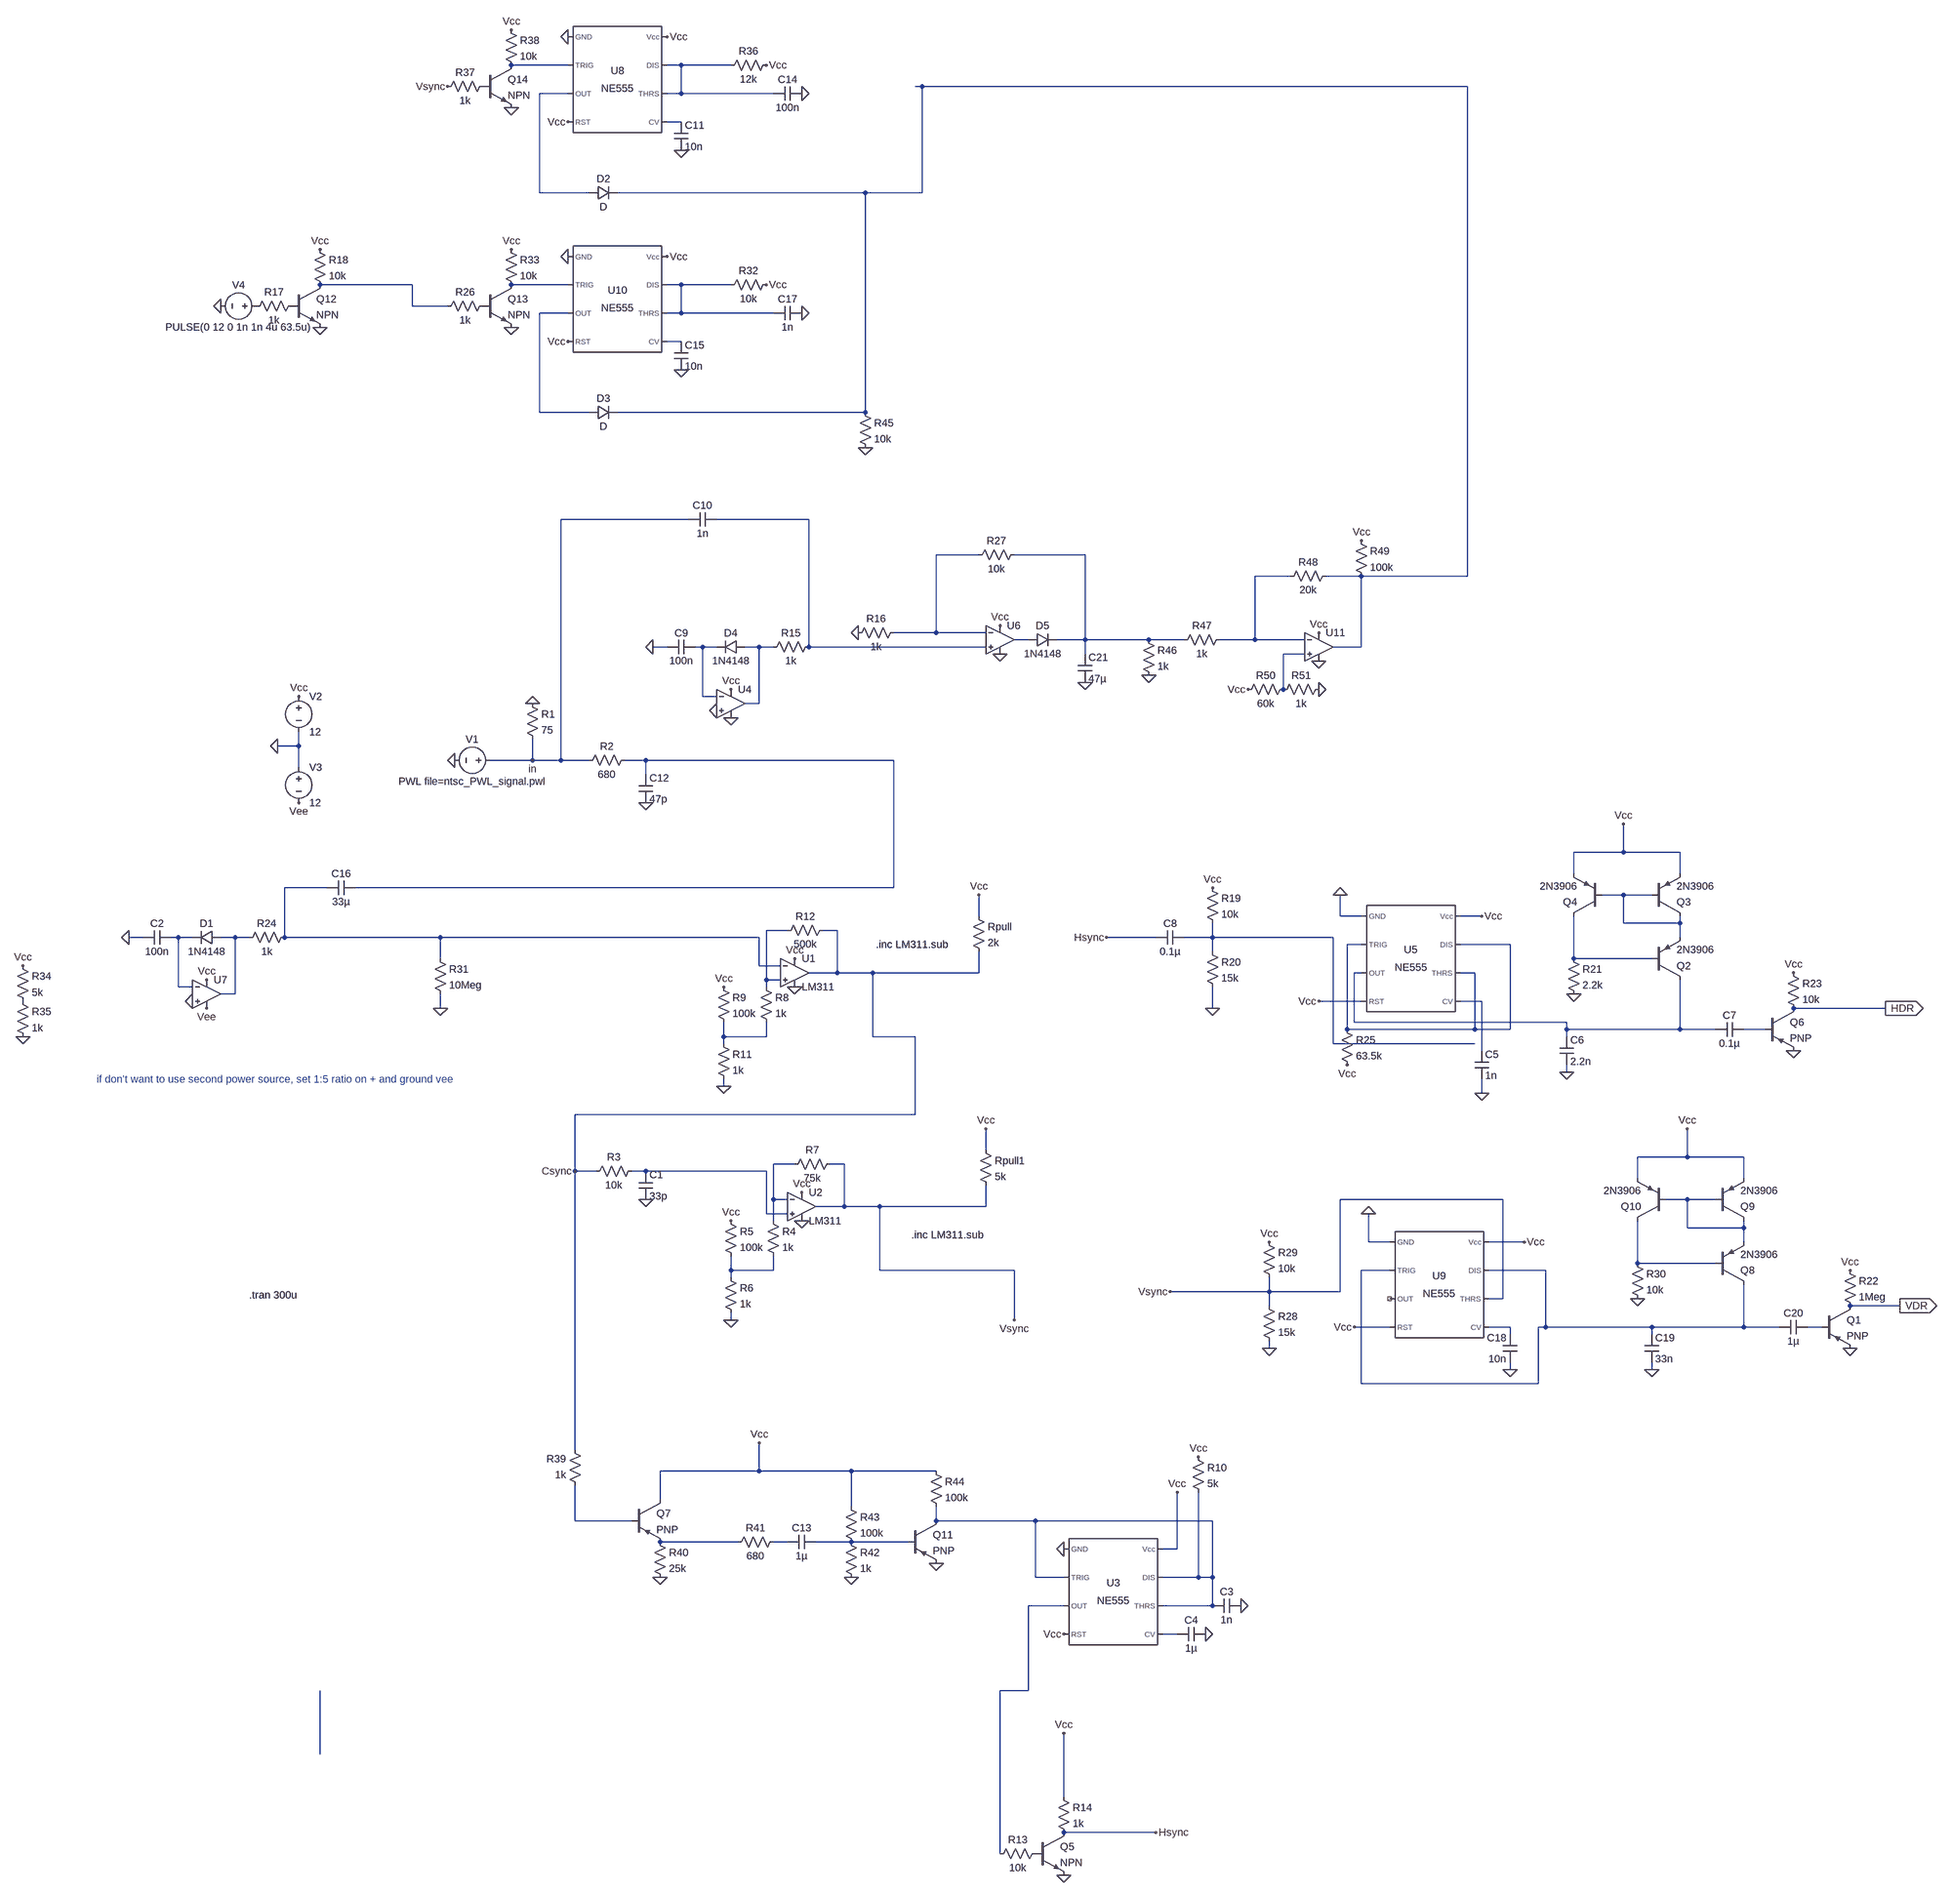
[diagram p0: schematic demoIteration.asc]
demoIteration.asc, the LTspice schematic file:
Version 4.1
SHEET 1 4812 2948
WIRE 240 -1840 112 -1840
WIRE 496 -1840 464 -1840
WIRE 608 -1840 496 -1840
WIRE 1040 -1792 1024 -1792
WIRE 2272 -1792 1040 -1792
WIRE 240 -1776 176 -1776
WIRE 496 -1776 496 -1840
WIRE 496 -1776 464 -1776
WIRE 704 -1776 496 -1776
WIRE 496 -1712 464 -1712
WIRE 176 -1552 176 -1776
WIRE 288 -1552 176 -1552
WIRE 912 -1552 352 -1552
WIRE 1040 -1552 1040 -1792
WIRE 1040 -1552 912 -1552
WIRE -112 -1344 -320 -1344
WIRE 240 -1344 112 -1344
WIRE 496 -1344 464 -1344
WIRE 608 -1344 496 -1344
WIRE -112 -1296 -112 -1344
WIRE -32 -1296 -112 -1296
WIRE 240 -1280 176 -1280
WIRE 496 -1280 496 -1344
WIRE 496 -1280 464 -1280
WIRE 704 -1280 496 -1280
WIRE 496 -1216 464 -1216
WIRE 176 -1056 176 -1280
WIRE 288 -1056 176 -1056
WIRE 912 -1056 912 -1552
WIRE 912 -1056 352 -1056
WIRE 512 -736 224 -736
WIRE 784 -736 576 -736
WIRE 1168 -656 1072 -656
WIRE 1408 -656 1248 -656
WIRE 1872 -608 1792 -608
WIRE 2032 -608 1952 -608
WIRE 2272 -608 2272 -1792
WIRE 2272 -608 2032 -608
WIRE 1072 -480 1072 -656
WIRE 1072 -480 976 -480
WIRE 1184 -480 1072 -480
WIRE 1280 -464 1248 -464
WIRE 1408 -464 1408 -656
WIRE 1408 -464 1344 -464
WIRE 1552 -464 1408 -464
WIRE 1632 -464 1552 -464
WIRE 1792 -464 1792 -608
WIRE 1792 -464 1712 -464
WIRE 1904 -464 1792 -464
WIRE 464 -448 432 -448
WIRE 544 -448 528 -448
WIRE 576 -448 544 -448
WIRE 672 -448 640 -448
WIRE 704 -448 672 -448
WIRE 784 -448 784 -736
WIRE 1184 -448 784 -448
WIRE 2032 -448 2032 -608
WIRE 2032 -448 1968 -448
WIRE 1408 -432 1408 -464
WIRE 1904 -432 1856 -432
WIRE 1856 -352 1856 -432
WIRE 544 -336 544 -448
WIRE 576 -336 544 -336
WIRE 672 -320 672 -448
WIRE 672 -320 640 -320
WIRE -368 -224 -368 -256
WIRE -368 -224 -416 -224
WIRE 160 -192 160 -240
WIRE 160 -192 64 -192
WIRE 224 -192 224 -736
WIRE 224 -192 160 -192
WIRE 288 -192 224 -192
WIRE 416 -192 368 -192
WIRE 976 -192 416 -192
WIRE -368 -176 -368 -224
WIRE 416 -160 416 -192
WIRE 2624 16 2624 -48
WIRE 2624 16 2512 16
WIRE 2752 16 2624 16
WIRE 2512 64 2512 16
WIRE 2752 64 2752 16
WIRE -304 96 -400 96
WIRE 976 96 976 -192
WIRE 976 96 -240 96
WIRE 2624 112 2576 112
WIRE 2688 112 2624 112
WIRE 1168 160 1168 112
WIRE 1984 160 1984 112
WIRE 2032 160 1984 160
WIRE 2304 160 2256 160
WIRE 2624 176 2624 112
WIRE 2752 176 2752 160
WIRE 2752 176 2624 176
WIRE 736 192 688 192
WIRE 848 192 816 192
WIRE -720 208 -752 208
WIRE -640 208 -656 208
WIRE -608 208 -640 208
WIRE -512 208 -544 208
WIRE -480 208 -512 208
WIRE -400 208 -400 96
WIRE -48 208 -400 208
WIRE 672 208 -48 208
WIRE 1568 208 1456 208
WIRE 1696 208 1696 176
WIRE 1696 208 1632 208
WIRE 1968 208 1696 208
WIRE 2752 208 2752 176
WIRE 2032 224 2000 224
WIRE 2368 224 2256 224
WIRE 1696 240 1696 208
WIRE -48 256 -48 208
WIRE 2512 256 2512 160
WIRE 2688 256 2512 256
WIRE 672 272 672 208
WIRE 720 272 672 272
WIRE 848 288 848 192
WIRE 848 288 784 288
WIRE 928 288 848 288
WIRE 1168 288 1168 240
WIRE 1168 288 928 288
WIRE 2032 288 2016 288
WIRE 2288 288 2256 288
WIRE 688 304 688 192
WIRE 720 304 688 304
WIRE -640 320 -640 208
WIRE -608 320 -640 320
WIRE 688 320 688 304
WIRE -512 336 -512 208
WIRE -512 336 -544 336
WIRE 2032 352 1936 352
WIRE 2304 352 2256 352
WIRE -48 368 -48 336
WIRE 1696 368 1696 320
WIRE 3216 368 3008 368
WIRE 2016 400 2016 288
WIRE 2496 400 2016 400
WIRE 2000 416 2000 224
WIRE 2288 416 2288 288
WIRE 2288 416 2000 416
WIRE 2368 416 2368 224
WIRE 2368 416 2288 416
WIRE 2496 416 2496 400
WIRE 2752 416 2752 304
WIRE 2752 416 2496 416
WIRE 2832 416 2752 416
WIRE 2944 416 2896 416
WIRE 592 432 592 400
WIRE 688 432 688 400
WIRE 688 432 592 432
WIRE 928 432 928 288
WIRE 1024 432 928 432
WIRE 2496 432 2496 416
WIRE 592 448 592 432
WIRE 1968 448 1968 208
WIRE 2288 448 1968 448
WIRE 2304 464 2304 352
WIRE 2496 512 2496 496
WIRE 592 544 592 528
WIRE 2304 560 2304 528
WIRE 1024 608 1024 432
WIRE 1024 608 256 608
WIRE 1184 688 1184 640
WIRE 2768 704 2768 640
WIRE 2768 704 2656 704
WIRE 2896 704 2768 704
WIRE 752 720 704 720
WIRE 864 720 832 720
WIRE 256 736 256 608
WIRE 304 736 256 736
WIRE 416 736 384 736
WIRE 688 736 416 736
WIRE 2656 752 2656 704
WIRE 2896 752 2896 704
WIRE 704 800 704 720
WIRE 736 800 704 800
WIRE 2352 800 1984 800
WIRE 2768 800 2720 800
WIRE 2832 800 2768 800
WIRE 864 816 864 720
WIRE 864 816 800 816
WIRE 944 816 864 816
WIRE 1184 816 1184 768
WIRE 1184 816 944 816
WIRE 688 832 688 736
WIRE 736 832 688 832
WIRE 704 848 704 800
WIRE 2768 864 2768 800
WIRE 2896 864 2896 848
WIRE 2896 864 2768 864
WIRE 2048 896 2048 832
WIRE 2096 896 2048 896
WIRE 2400 896 2320 896
WIRE 2896 896 2896 864
WIRE 2656 944 2656 848
WIRE 2832 944 2656 944
WIRE 608 960 608 928
WIRE 704 960 704 928
WIRE 704 960 608 960
WIRE 944 960 944 816
WIRE 1248 960 944 960
WIRE 2096 960 2032 960
WIRE 2448 960 2320 960
WIRE 608 976 608 960
WIRE 1824 1008 1824 976
WIRE 1824 1008 1600 1008
WIRE 1984 1008 1984 800
WIRE 1984 1008 1824 1008
WIRE 2352 1024 2352 800
WIRE 2352 1024 2320 1024
WIRE 1824 1040 1824 1008
WIRE 3248 1040 3136 1040
WIRE 608 1072 608 1056
WIRE 1248 1072 1248 960
WIRE 2096 1088 2016 1088
WIRE 2368 1088 2320 1088
WIRE 2448 1088 2448 960
WIRE 2448 1088 2432 1088
WIRE 2688 1088 2448 1088
WIRE 2896 1088 2896 992
WIRE 2896 1088 2688 1088
WIRE 2976 1088 2896 1088
WIRE 3072 1088 3040 1088
WIRE 2368 1104 2368 1088
WIRE 2688 1104 2688 1088
WIRE 1824 1136 1824 1120
WIRE 2368 1184 2368 1168
WIRE 2688 1184 2688 1168
WIRE 2032 1216 2032 960
WIRE 2432 1216 2432 1088
WIRE 2432 1216 2032 1216
WIRE 256 1472 256 736
WIRE 672 1520 672 1456
WIRE 672 1520 448 1520
WIRE 880 1520 672 1520
WIRE 1072 1520 880 1520
WIRE 448 1584 448 1520
WIRE 880 1600 880 1520
WIRE 256 1632 256 1552
WIRE 384 1632 256 1632
WIRE 1072 1632 1072 1600
WIRE 1296 1632 1072 1632
WIRE 1696 1632 1296 1632
WIRE 624 1680 448 1680
WIRE 736 1680 704 1680
WIRE 880 1680 800 1680
WIRE 1008 1680 880 1680
WIRE 1616 1696 1616 1568
WIRE 1616 1696 1584 1696
WIRE 1296 1760 1296 1632
WIRE 1360 1760 1296 1760
WIRE 1664 1760 1664 1568
WIRE 1664 1760 1584 1760
WIRE 1696 1760 1696 1632
WIRE 1696 1760 1664 1760
WIRE 1360 1824 1280 1824
WIRE 1696 1824 1696 1760
WIRE 1696 1824 1584 1824
WIRE 1616 1888 1584 1888
WIRE 1280 2016 1280 1824
WIRE 1280 2016 1216 2016
WIRE -320 2160 -320 2016
WIRE 1360 2256 1360 2112
WIRE 1568 2336 1360 2336
WIRE 1216 2384 1216 2016
FLAG -16 -192 0
FLAG 160 -320 0
FLAG 1696 96 Vcc
FLAG 1696 368 0
FLAG 1984 112 0
FLAG 2304 560 0
FLAG 2496 512 0
FLAG 2512 336 0
FLAG 3216 368 HDR
IOPIN 3216 368 Out
FLAG 1456 208 Hsync
FLAG 416 -96 0
FLAG 592 544 0
FLAG 752 256 Vcc
FLAG -368 -336 Vcc
FLAG -368 -96 Vee
FLAG -416 -224 0
FLAG 2304 160 Vcc
FLAG 2624 -48 Vcc
FLAG 1936 352 Vcc
FLAG 1168 112 Vcc
FLAG 592 320 Vcc
FLAG -48 368 0
FLAG 416 800 0
FLAG -752 208 0
FLAG -576 304 Vcc
FLAG 608 1072 0
FLAG 1184 640 Vcc
FLAG 608 848 Vcc
FLAG 768 848 0
FLAG 1248 1072 Vsync
FLAG 1824 1136 0
FLAG 1824 896 Vcc
FLAG 2400 896 Vcc
FLAG 2048 832 0
FLAG 2368 1184 0
FLAG 2016 1088 Vcc
FLAG 2656 1024 0
FLAG 2768 640 Vcc
FLAG 2688 1184 0
FLAG 3248 1040 VDR
IOPIN 3248 1040 Out
FLAG 1600 1008 Vsync
FLAG 256 736 Csync
FLAG 1360 1696 0
FLAG 1360 1888 Vcc
FLAG 1760 1824 0
FLAG 1664 1488 Vcc
FLAG 1680 1888 0
FLAG 1360 2432 0
FLAG 3008 288 Vcc
FLAG 3008 464 0
FLAG -1056 432 0
FLAG -1056 272 Vcc
FLAG -608 352 0
FLAG 160 -192 in
FLAG 448 1760 0
FLAG 880 1760 0
FLAG 672 1456 Vcc
FLAG 1072 1728 0
FLAG 1360 2112 Vcc
FLAG 1616 1568 Vcc
FLAG 768 784 Vcc
FLAG 240 -1408 0
FLAG 240 -1216 Vcc
FLAG 496 -1152 0
FLAG 768 -1280 0
FLAG 688 -1344 Vcc
FLAG 464 -1408 Vcc
FLAG 112 -1248 0
FLAG 112 -1424 Vcc
FLAG -32 -1792 Vsync
FLAG 240 -1904 0
FLAG 240 -1712 Vcc
FLAG 496 -1648 0
FLAG 768 -1776 0
FLAG 688 -1840 Vcc
FLAG 464 -1904 Vcc
FLAG 112 -1744 0
FLAG 112 -1920 Vcc
FLAG 912 -976 0
FLAG -576 368 Vee
FLAG 752 320 0
FLAG 2000 496 Vcc
FLAG 1568 2336 Hsync
FLAG 3136 1136 0
FLAG 3136 960 Vcc
FLAG -544 -1296 0
FLAG -320 -1248 0
FLAG -320 -1424 Vcc
FLAG 432 -448 0
FLAG 608 -352 Vcc
FLAG 576 -304 0
FLAG 1216 -496 Vcc
FLAG 896 -480 0
FLAG 1408 -368 0
FLAG 1552 -384 0
FLAG 1936 -480 Vcc
FLAG 2032 -688 Vcc
FLAG 608 -288 0
FLAG 1936 -352 0
FLAG 1776 -352 Vcc
FLAG 1936 -416 0
FLAG 1216 -432 0
DATAFLAG 592 432 ""
DATAFLAG 608 960 ""
SYMBOL voltage 80 -192 R90
WINDOW 0 -32 56 VBottom 2
WINDOW 3 32 56 VTop 2
WINDOW 123 0 0 Left 0
WINDOW 39 0 0 Left 0
SYMATTR InstName V1
SYMATTR Value PWL file=ntsc_PWL_signal.pwl
SYMBOL res 144 -336 R0
SYMATTR InstName R1
SYMATTR Value 75
SYMBOL Misc\\NE555 2144 256 R0
SYMATTR InstName U5
SYMBOL res 1680 80 R0
SYMATTR InstName R19
SYMATTR Value 10k
SYMBOL res 1680 224 R0
SYMATTR InstName R20
SYMATTR Value 15k
SYMBOL cap 2288 464 R0
SYMATTR InstName C5
SYMATTR Value 1n
SYMBOL cap 2480 432 R0
SYMATTR InstName C6
SYMATTR Value 2.2n
SYMBOL cap 2896 400 R90
WINDOW 0 0 32 VBottom 2
WINDOW 3 32 32 VTop 2
SYMATTR InstName C7
SYMATTR Value 0.1µ
SYMBOL pnp 2688 304 M180
SYMATTR InstName Q2
SYMATTR Value 2N3906
SYMBOL pnp 2688 160 M180
SYMATTR InstName Q3
SYMATTR Value 2N3906
SYMBOL pnp 2576 160 R180
SYMATTR InstName Q4
SYMATTR Value 2N3906
SYMBOL res 2496 240 R0
SYMATTR InstName R21
SYMATTR Value 2.2k
SYMBOL cap 1632 192 R90
WINDOW 0 0 32 VBottom 2
WINDOW 3 32 32 VTop 2
SYMATTR InstName C8
SYMATTR Value 0.1µ
SYMBOL res 384 -208 R90
WINDOW 0 0 56 VBottom 2
WINDOW 3 32 56 VTop 2
SYMATTR InstName R2
SYMATTR Value 680
SYMBOL cap 400 -160 R0
SYMATTR InstName C12
SYMATTR Value 47p
SYMBOL res 672 304 R0
SYMATTR InstName R8
SYMATTR Value 1k
SYMBOL res 576 304 R0
SYMATTR InstName R9
SYMATTR Value 100k
SYMBOL res 576 432 R0
SYMATTR InstName R11
SYMATTR Value 1k
SYMBOL res 832 176 R90
WINDOW 0 0 56 VBottom 2
WINDOW 3 32 56 VTop 2
SYMATTR InstName R12
SYMATTR Value 500k
SYMBOL res 1152 144 R0
SYMATTR InstName Rpull
SYMATTR Value 2k
SYMBOL voltage -368 -352 R0
SYMATTR InstName V2
SYMATTR Value 12
SYMBOL voltage -368 -192 R0
SYMATTR InstName V3
SYMATTR Value 12
SYMBOL OpAmps\\opamp2 752 224 R0
SYMATTR InstName U1
SYMATTR Value LM311
SYMBOL res -64 240 R0
SYMATTR InstName R31
SYMATTR Value 10Meg
SYMBOL res 400 720 R90
WINDOW 0 0 56 VBottom 2
WINDOW 3 32 56 VTop 2
SYMATTR InstName R3
SYMATTR Value 10k
SYMBOL cap 400 736 R0
SYMATTR InstName C1
SYMATTR Value 33p
SYMBOL res -384 192 R90
WINDOW 0 0 56 VBottom 2
WINDOW 3 32 56 VTop 2
SYMATTR InstName R24
SYMATTR Value 1k
SYMBOL diode -544 192 R90
WINDOW 0 0 32 VBottom 2
WINDOW 3 32 32 VTop 2
SYMATTR InstName D1
SYMATTR Value 1N4148
SYMBOL cap -656 192 R90
WINDOW 0 0 32 VBottom 2
WINDOW 3 32 32 VTop 2
SYMATTR InstName C2
SYMATTR Value 100n
SYMBOL OpAmps\\UniversalOpAmp2 -576 336 R0
SYMATTR InstName U7
SYMBOL cap -240 80 R90
WINDOW 0 0 32 VBottom 2
WINDOW 3 32 32 VTop 2
SYMATTR InstName C16
SYMATTR Value 33µ
SYMBOL res 688 832 R0
SYMATTR InstName R4
SYMATTR Value 1k
SYMBOL res 592 832 R0
SYMATTR InstName R5
SYMATTR Value 100k
SYMBOL res 592 960 R0
SYMATTR InstName R6
SYMATTR Value 1k
SYMBOL res 848 704 R90
WINDOW 0 0 56 VBottom 2
WINDOW 3 32 56 VTop 2
SYMATTR InstName R7
SYMATTR Value 75k
SYMBOL res 1168 672 R0
SYMATTR InstName Rpull1
SYMATTR Value 5k
SYMBOL OpAmps\\opamp2 768 752 R0
SYMATTR InstName U2
SYMATTR Value LM311
SYMBOL res 1808 1024 R0
SYMATTR InstName R28
SYMATTR Value 15k
SYMBOL res 1808 880 R0
SYMATTR InstName R29
SYMATTR Value 10k
SYMBOL Misc\\NE555 2208 992 R0
SYMATTR InstName U9
SYMBOL cap 2384 1168 R180
WINDOW 0 24 56 Left 2
WINDOW 3 24 8 Left 2
SYMATTR InstName C18
SYMATTR Value 10n
SYMBOL pnp 2832 992 M180
SYMATTR InstName Q8
SYMATTR Value 2N3906
SYMBOL pnp 2832 848 M180
SYMATTR InstName Q9
SYMATTR Value 2N3906
SYMBOL pnp 2720 848 R180
SYMATTR InstName Q10
SYMATTR Value 2N3906
SYMBOL res 2640 928 R0
SYMATTR InstName R30
SYMATTR Value 10k
SYMBOL cap 2672 1104 R0
SYMATTR InstName C19
SYMATTR Value 33n
SYMBOL cap 3040 1072 R90
WINDOW 0 0 32 VBottom 2
WINDOW 3 32 32 VTop 2
SYMATTR InstName C20
SYMATTR Value 1µ
SYMBOL Misc\\NE555 1472 1792 R0
SYMATTR InstName U3
SYMBOL cap 1760 1808 R90
WINDOW 0 0 32 VBottom 2
WINDOW 3 32 32 VTop 2
SYMATTR InstName C3
SYMATTR Value 1n
SYMBOL res 1648 1472 R0
SYMATTR InstName R10
SYMATTR Value 5k
SYMBOL cap 1680 1872 R90
WINDOW 0 0 32 VBottom 2
WINDOW 3 32 32 VTop 2
SYMATTR InstName C4
SYMATTR Value 1µ
SYMBOL res 1312 2368 R90
WINDOW 0 0 56 VBottom 2
WINDOW 3 32 56 VTop 2
SYMATTR InstName R13
SYMATTR Value 10k
SYMBOL npn 1296 2336 R0
SYMATTR InstName Q5
SYMBOL res 1344 2240 R0
SYMATTR InstName R14
SYMATTR Value 1k
SYMBOL res 2992 272 R0
SYMATTR InstName R23
SYMATTR Value 10k
SYMBOL pnp 2944 368 R0
SYMATTR InstName Q6
SYMBOL res -1072 256 R0
SYMATTR InstName R34
SYMATTR Value 5k
SYMBOL res -1072 336 R0
SYMATTR InstName R35
SYMATTR Value 1k
SYMBOL res 272 1568 R180
WINDOW 0 36 76 Left 2
WINDOW 3 36 40 Left 2
SYMATTR InstName R39
SYMATTR Value 1k
SYMBOL res 432 1664 R0
SYMATTR InstName R40
SYMATTR Value 25k
SYMBOL res 720 1664 R90
WINDOW 0 0 56 VBottom 2
WINDOW 3 32 56 VTop 2
SYMATTR InstName R41
SYMATTR Value 680
SYMBOL cap 736 1696 R270
WINDOW 0 32 32 VTop 2
WINDOW 3 0 32 VBottom 2
SYMATTR InstName C13
SYMATTR Value 1µ
SYMBOL res 864 1664 R0
SYMATTR InstName R42
SYMATTR Value 1k
SYMBOL res 864 1584 R0
SYMATTR InstName R43
SYMATTR Value 100k
SYMBOL res 1056 1504 R0
SYMATTR InstName R44
SYMATTR Value 100k
SYMBOL Misc\\NE555 352 -1312 R0
SYMATTR InstName U10
SYMBOL cap 480 -1216 R0
SYMATTR InstName C15
SYMATTR Value 10n
SYMBOL res 704 -1360 R90
WINDOW 0 0 56 VBottom 2
WINDOW 3 32 56 VTop 2
SYMATTR InstName R32
SYMATTR Value 10k
SYMBOL cap 768 -1296 R90
WINDOW 0 0 32 VBottom 2
WINDOW 3 32 32 VTop 2
SYMATTR InstName C17
SYMATTR Value 1n
SYMBOL npn 48 -1344 R0
SYMATTR InstName Q13
SYMBOL res 64 -1312 R90
WINDOW 0 0 56 VBottom 2
WINDOW 3 32 56 VTop 2
SYMATTR InstName R26
SYMATTR Value 1k
SYMBOL res 96 -1440 R0
SYMATTR InstName R33
SYMATTR Value 10k
SYMBOL Misc\\NE555 352 -1808 R0
SYMATTR InstName U8
SYMBOL cap 480 -1712 R0
SYMATTR InstName C11
SYMATTR Value 10n
SYMBOL res 704 -1856 R90
WINDOW 0 0 56 VBottom 2
WINDOW 3 32 56 VTop 2
SYMATTR InstName R36
SYMATTR Value 12k
SYMBOL cap 768 -1792 R90
WINDOW 0 0 32 VBottom 2
WINDOW 3 32 32 VTop 2
SYMATTR InstName C14
SYMATTR Value 100n
SYMBOL npn 48 -1840 R0
SYMATTR InstName Q14
SYMBOL res 64 -1808 R90
WINDOW 0 0 56 VBottom 2
WINDOW 3 32 56 VTop 2
SYMATTR InstName R37
SYMATTR Value 1k
SYMBOL res 96 -1936 R0
SYMATTR InstName R38
SYMATTR Value 10k
SYMBOL diode 288 -1536 R270
WINDOW 0 32 32 VTop 2
WINDOW 3 0 32 VBottom 2
SYMATTR InstName D2
SYMBOL diode 288 -1040 R270
WINDOW 0 32 32 VTop 2
WINDOW 3 0 32 VBottom 2
SYMATTR InstName D3
SYMBOL res 896 -1072 R0
SYMATTR InstName R45
SYMATTR Value 10k
SYMBOL res 1984 400 R0
SYMATTR InstName R25
SYMATTR Value 63.5k
SYMBOL res 3120 944 R0
SYMATTR InstName R22
SYMATTR Value 1Meg
SYMBOL pnp 3072 1040 R0
SYMATTR InstName Q1
SYMBOL voltage -448 -1296 R90
WINDOW 0 -32 56 VBottom 2
WINDOW 3 32 56 VTop 2
WINDOW 123 0 0 Left 0
WINDOW 39 0 0 Left 0
SYMATTR InstName V4
SYMATTR Value PULSE(0 12 0 1n 1n 4u 63.5u)
SYMBOL res -368 -1312 R90
WINDOW 0 0 56 VBottom 2
WINDOW 3 32 56 VTop 2
SYMATTR InstName R17
SYMATTR Value 1k
SYMBOL npn -384 -1344 R0
SYMATTR InstName Q12
SYMBOL res -336 -1440 R0
SYMATTR InstName R18
SYMATTR Value 10k
SYMBOL res 800 -464 R90
WINDOW 0 0 56 VBottom 2
WINDOW 3 32 56 VTop 2
SYMATTR InstName R15
SYMATTR Value 1k
SYMBOL diode 640 -464 R90
WINDOW 0 0 32 VBottom 2
WINDOW 3 32 32 VTop 2
SYMATTR InstName D4
SYMATTR Value 1N4148
SYMBOL cap 528 -464 R90
WINDOW 0 0 32 VBottom 2
WINDOW 3 32 32 VTop 2
SYMATTR InstName C9
SYMATTR Value 100n
SYMBOL OpAmps\\UniversalOpAmp2 608 -320 R0
SYMATTR InstName U4
SYMBOL cap 576 -752 R90
WINDOW 0 0 32 VBottom 2
WINDOW 3 32 32 VTop 2
SYMATTR InstName C10
SYMATTR Value 1n
SYMBOL OpAmps\\UniversalOpAmp2 1216 -464 R0
SYMATTR InstName U6
SYMBOL diode 1280 -448 R270
WINDOW 0 32 32 VTop 2
WINDOW 3 0 32 VBottom 2
SYMATTR InstName D5
SYMATTR Value 1N4148
SYMBOL res 992 -496 R90
WINDOW 0 0 56 VBottom 2
WINDOW 3 32 56 VTop 2
SYMATTR InstName R16
SYMATTR Value 1k
SYMBOL res 1264 -672 R90
WINDOW 0 0 56 VBottom 2
WINDOW 3 32 56 VTop 2
SYMATTR InstName R27
SYMATTR Value 10k
SYMBOL cap 1392 -432 R0
SYMATTR InstName C21
SYMATTR Value 47µ
SYMBOL res 1536 -480 R0
SYMATTR InstName R46
SYMATTR Value 1k
SYMBOL res 1728 -480 R90
WINDOW 0 0 56 VBottom 2
WINDOW 3 32 56 VTop 2
SYMATTR InstName R47
SYMATTR Value 1k
SYMBOL OpAmps\\UniversalOpAmp2 1936 -448 R0
SYMATTR InstName U11
SYMBOL res 1968 -624 R90
WINDOW 0 0 56 VBottom 2
WINDOW 3 32 56 VTop 2
SYMATTR InstName R48
SYMATTR Value 20k
SYMBOL res 2016 -704 R0
SYMATTR InstName R49
SYMATTR Value 100k
SYMBOL res 1872 -368 R90
WINDOW 0 0 56 VBottom 2
WINDOW 3 32 56 VTop 2
SYMATTR InstName R50
SYMATTR Value 60k
SYMBOL res 1952 -368 R90
WINDOW 0 0 56 VBottom 2
WINDOW 3 32 56 VTop 2
SYMATTR InstName R51
SYMATTR Value 1k
SYMBOL pnp 384 1584 R0
SYMATTR InstName Q7
SYMBOL pnp 1008 1632 R0
SYMATTR InstName Q11
TEXT -480 1016 Left 2 !.tran 300u
TEXT 936 224 Left 2 !.inc LM311.sub
TEXT 1016 880 Left 2 !.inc LM311.sub
TEXT -824 528 Left 2 ;if don't want to use second power source, set 1:5 ratio on + and ground vee

The netlist it stands for:
* demoIteration.asc
V1 in 0 PWL file=ntsc_PWL_signal.pwl
R1 0 in 75
X§U5 0 N026 N028 Vcc N029 N026 N026 Vcc NE555  ; pins GND TRIG OUT RST CV THRS DIS Vcc
R19 Vcc N025 10k
R20 N025 0 15k
C5 N029 0 1n
C6 N028 0 2.2n
C7 N030 N028 0.1µ
Q2 N028 N027 N021 0 2N3906
Q3 N021 N021 Vcc 0 2N3906
Q4 N027 N021 Vcc 0 2N3906
R21 N027 0 2.2k
C8 N025 Hsync 0.1µ
R2 N019 in 680
C12 N019 0 47p
R8 N022 N031 1k
R9 Vcc N031 100k
R11 N031 0 1k
R12 Csync N022 500k
Rpull Vcc Csync 2k
V2 Vcc 0 12
V3 0 Vee 12
X§U1 N022 N020 Vcc 0 Csync LM311  ; pins In+ In- V+ V- OUT
R31 N020 0 10Meg
R3 N033 Csync 10k
C1 N033 0 33p
R24 N020 N024 1k
D1 N024 N023 1N4148
C2 N023 0 100n
X§U7 0 N023 Vcc Vee N024 level2 Avol=1Meg GBW=10Meg Slew=10Meg Ilimit=25m Rail=0 Vos=0 En=0 Enk=0 In=0 Ink=0 Rin=500Meg  ; pins In+ In- V+ V- OUT
C16 N019 N020 33µ
R4 N032 N036 1k
R5 Vcc N036 100k
R6 N036 0 1k
R7 Vsync N032 75k
Rpull1 Vcc Vsync 5k
X§U2 N033 N032 Vcc 0 Vsync LM311  ; pins In+ In- V+ V- OUT
R28 Vsync 0 15k
R29 Vcc Vsync 10k
X§U9 0 N037 NC_01 Vcc N038 Vsync N037 Vcc NE555  ; pins GND TRIG OUT RST CV THRS DIS Vcc
C18 0 N038 10n
Q8 N037 N035 N034 0 2N3906
Q9 N034 N034 Vcc 0 2N3906
Q10 N035 N034 Vcc 0 2N3906
R30 N035 0 10k
C19 N037 0 33n
C20 N039 N037 1µ
X§U3 0 N041 N045 Vcc N046 N041 N041 Vcc NE555  ; pins GND TRIG OUT RST CV THRS DIS Vcc
C3 0 N041 1n
R10 Vcc N041 5k
C4 0 N046 1µ
R13 P001 N045 10k
Q5 Hsync P001 0 0 NPN
R14 Vcc Hsync 1k
R23 Vcc HDR 10k
Q6 HDR N030 0 0 PNP
R34 Vcc P002 5k
R35 P002 0 1k
R39 N040 Csync 1k
R40 N042 0 25k
R41 N043 N042 680
C13 N043 N044 1µ
R42 N044 0 1k
R43 Vcc N044 100k
R44 Vcc N041 100k
X§U10 0 N007 N009 Vcc N010 N008 N008 Vcc NE555  ; pins GND TRIG OUT RST CV THRS DIS Vcc
C15 N010 0 10n
R32 Vcc N008 10k
C17 0 N008 1n
Q13 N007 P003 0 0 NPN
R26 P003 N006 1k
R33 Vcc N007 10k
X§U8 0 N001 N004 Vcc N005 N002 N002 Vcc NE555  ; pins GND TRIG OUT RST CV THRS DIS Vcc
C11 N005 0 10n
R36 Vcc N002 12k
C14 0 N002 100n
Q14 N001 P004 0 0 NPN
R37 P004 Vsync 1k
R38 Vcc N001 10k
D2 N004 N003 D
D3 N009 N003 D
R45 N003 0 10k
R25 N026 Vcc 63.5k
R22 Vcc VDR 1Meg
Q1 VDR N039 0 0 PNP
V4 P005 0 PULSE(0 12 0 1n 1n 4u 63.5u)
R17 P006 P005 1k
Q12 N006 P006 0 0 NPN
R18 Vcc N006 10k
R15 N011 N017 1k
D4 N017 N016 1N4148
C9 N016 0 100n
X§U4 0 N016 Vcc 0 N017 level2 Avol=1Meg GBW=10Meg Slew=10Meg Ilimit=25m Rail=0 Vos=0 En=0 Enk=0 In=0 Ink=0 Rin=500Meg  ; pins In+ In- V+ V- OUT
C10 N011 in 1n
X§U6 N011 N012 Vcc 0 N015 level2 Avol=1Meg GBW=10Meg Slew=10Meg Ilimit=25m Rail=0 Vos=0 En=0 Enk=0 In=0 Ink=0 Rin=500Meg  ; pins In+ In- V+ V- OUT
D5 N015 N013 1N4148
R16 N012 0 1k
R27 N013 N012 10k
C21 N013 0 47µ
R46 N013 0 1k
R47 N014 N013 1k
X§U11 N018 N014 Vcc 0 N003 level2 Avol=1Meg GBW=10Meg Slew=10Meg Ilimit=25m Rail=0 Vos=0 En=0 Enk=0 In=0 Ink=0 Rin=500Meg  ; pins In+ In- V+ V- OUT
R48 N003 N014 20k
R49 Vcc N003 100k
R50 N018 Vcc 60k
R51 0 N018 1k
Q7 Vcc N040 N042 0 PNP
Q11 N041 N044 0 0 PNP
.model D D
.lib standard.dio
.model NPN NPN
.model PNP PNP
.lib standard.bjt
.tran 300u
.inc LM311.sub
.inc LM311.sub
* if don't want to use second power source, set 1:5 ratio on + and ground vee
.lib NE555.sub
.lib UniversalOpAmp2.lib
.backanno
.end